# EAGLE design Telit2XBEE (EAGLE 7.5.0)
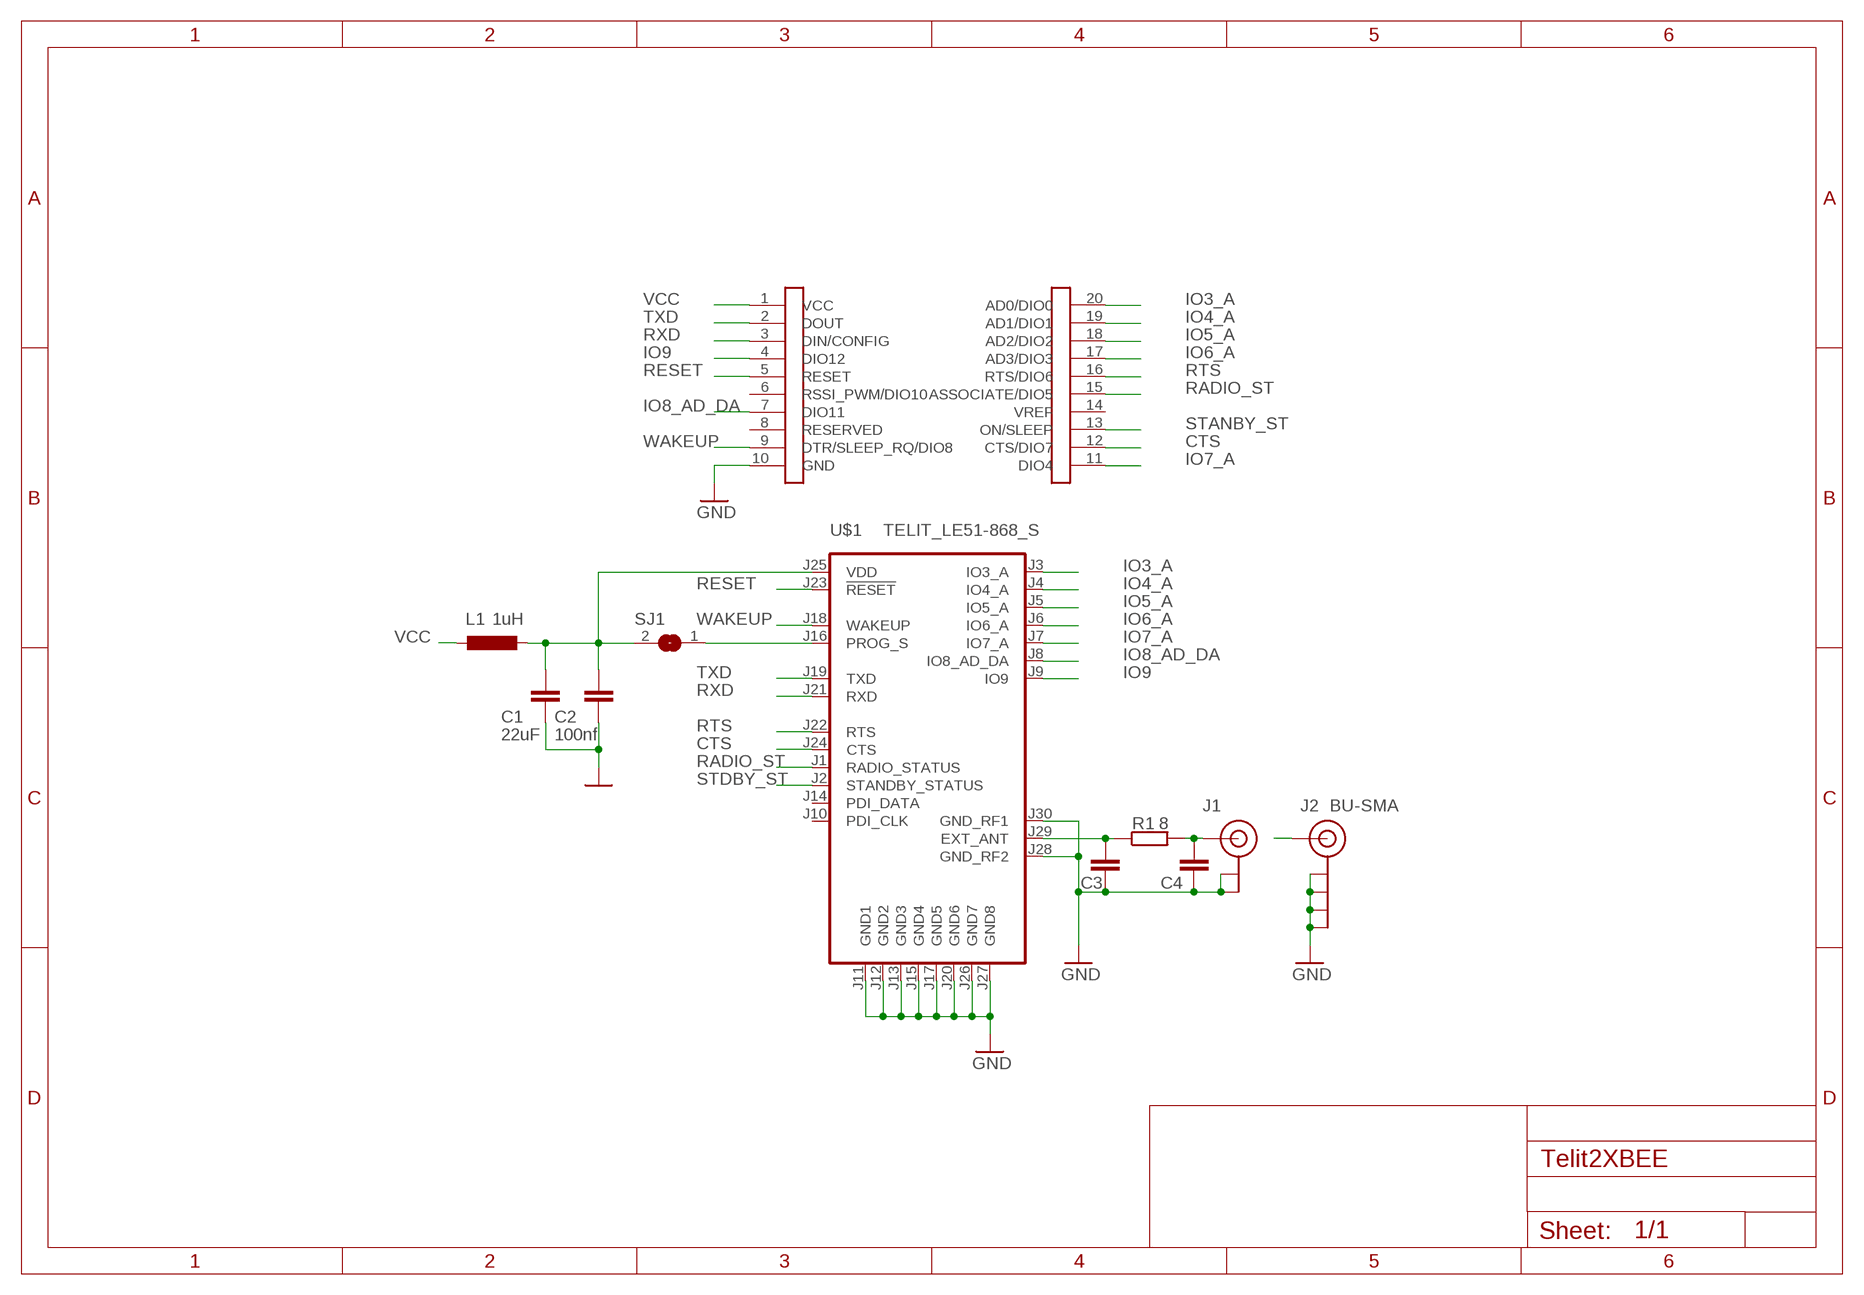
[diagram p0: schematic, sheet 1]

## Parts
C1  22uF  C-EUC1206  [C1206]
C2  100nf  C-EUC0805  [C0805]
C3  C-EUC0201  [C0201]
C4  C-EUC0201  [C0201]
J1  U.FL  U.FL1PAD  [U.FL_1PAD]
J2  BU-SMA  [BU-SMA-G]
L1  1uH  POWER_INDUCTOR3  [COILCRAFT_LPS3015]
R1  8  R-EU_R0201  [R0201]
SJ1  SJ  [SJ]
U$1  TELIT_LE51-868_S  TELIT_LE51  [TELIT_LE51]
U$2  XBEE_PIN_HEADER  [XBEE_PIN_HEADER]

## Nets
CTS: U$1.J24(CTS) U$2.12(CTS/DIO7)
GND: C1.2 C2.2 C3.2 C4.2 J1.P$1(GND) J1.P$2(GND) J2.P$2(GND) J2.P$3(GND) J2.P$5(GND) J2.P$6(GND) U$1.J11(GND1) U$1.J12(GND2) U$1.J13(GND3) U$1.J15(GND4) U$1.J17(GND5) U$1.J20(GND6) U$1.J26(GND7) U$1.J27(GND8) U$1.J28(GND_RF2) U$1.J30(GND_RF1) U$2.10(GND)
IO3_A: U$1.J3(IO3_A) U$2.20(AD0/DIO0)
IO4_A: U$1.J4(IO4_A) U$2.19(AD1/DIO1)
IO5_A: U$1.J5(IO5_A) U$2.18(AD2/DIO2)
IO6_A: U$1.J6(IO6_A) U$2.17(AD3/DIO3)
IO7_A: U$1.J7(IO7_A) U$2.11(DIO4)
IO8_AD_DA: U$1.J8(IO8_AD_DA) U$2.7(DIO11)
IO9: U$1.J9(IO9) U$2.4(DIO12)
N$1: SJ1.1 U$1.J16(PROG_S)
N$2: C4.1 J1.P$3(SIGNAL) J2.P$1(SIGNAL) R1.2
N$3: C3.1 R1.1 U$1.J29(EXT_ANT)
N$18 [VCC1]: C1.1 C2.1 L1.P$2 SJ1.2 U$1.J25(VDD)
RADIO_ST: U$1.J1(RADIO_STATUS) U$2.15(ASSOCIATE/DIO5)
RESET: U$1.J23(!RESET) U$2.5(RESET)
RTS: U$1.J22(RTS) U$2.16(RTS/DIO6)
RXD: U$1.J21(RXD) U$2.3(DIN/CONFIG)
STANBY_ST: U$2.13(ON/SLEEP)
STDBY_ST: U$1.J2(STANDBY_STATUS)
TXD: U$1.J19(TXD) U$2.2(DOUT)
VCC [VCC1]: L1.P$1 U$2.1(VCC)
WAKEUP: U$1.J18(WAKEUP) U$2.9(DTR/SLEEP_RQ/DIO8)
Unconnected: U$1.J10(PDI_CLK) U$1.J14(PDI_DATA) U$2.6(RSSI_PWM/DIO10) U$2.8(RESERVED) U$2.14(VREF)

## Library data of the parts
C1-C4 = resistor:C-EU: CAPACITOR, European symbol
J1 = Multiconnect_base:U.FL: SMD antenna connector- WRL-09144
J2 = Multiconnect_base:BU-SMA
L1 = Multiconnect_base:POWER_INDUCTOR: COILCRAFT
R1 = resistor:R-EU_: RESISTOR, European symbol
SJ1 = jumper:SJ: SMD solder JUMPER
U$1 = Multiconnect_base:TELIT_LE51
U$2 = Multiconnect_base:XBEE_PIN_HEADER

## Net classes
0 default: width 0.152 mm, clearance 0.152 mm
1 VCC1: width 0.254 mm, clearance 0.152 mm

## Board
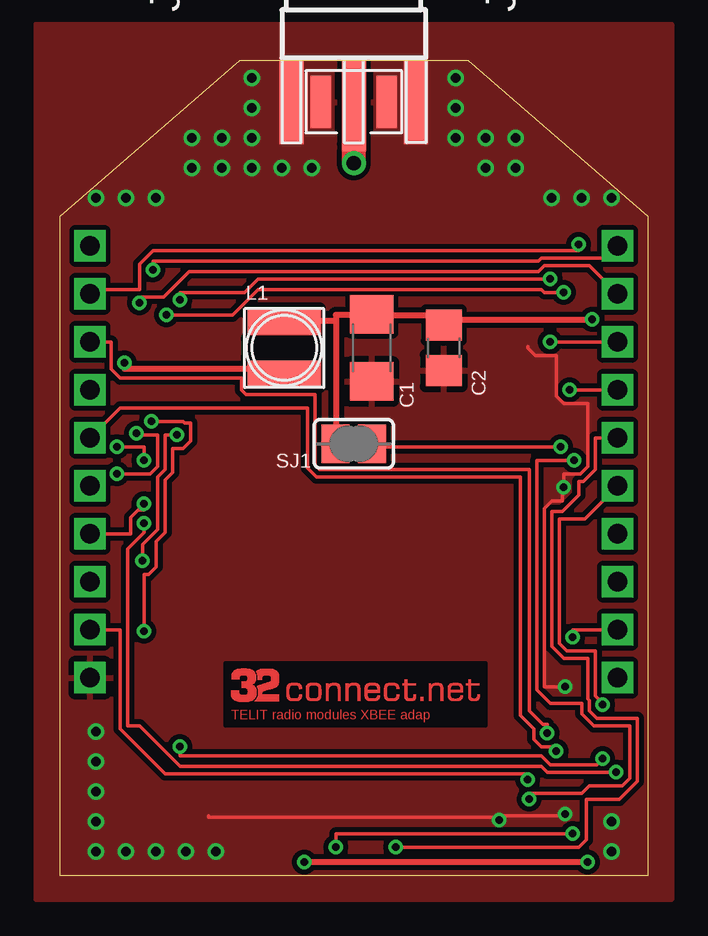
[diagram p1: board, top side]
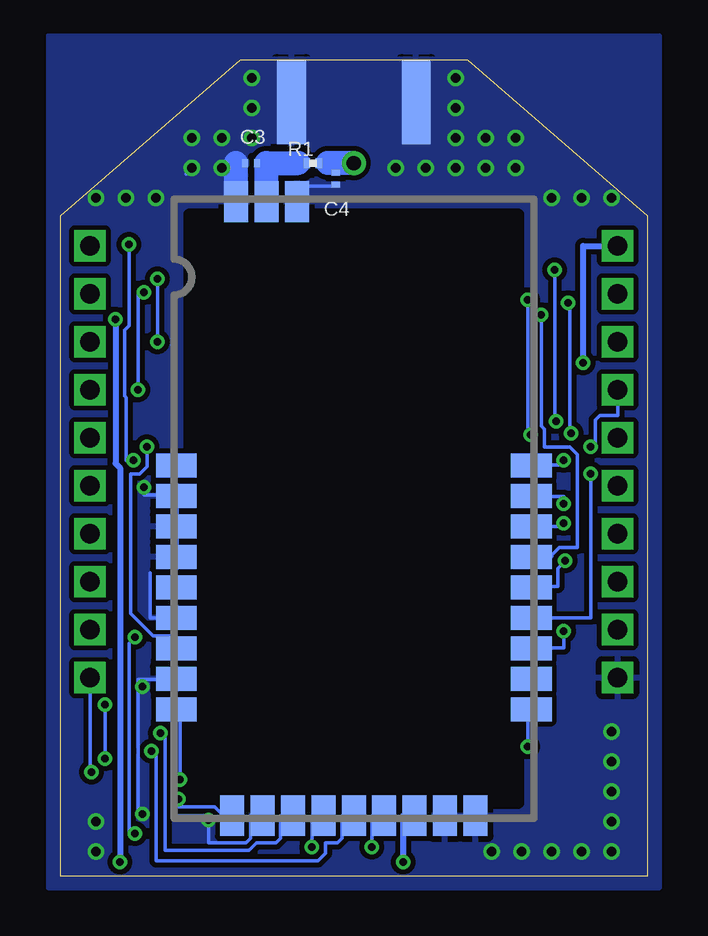
[diagram p2: board, bottom side, seen from below]

Size 24.5 x 34 mm. Coordinates in mm from the lower left corner, seen from the top.
Outline: 0,0 0,27.5 7.5,34 17,34 24.5,27.5 24.5,0 0,0
Copper layers (1*16): Top 0.035mm / dielectric 1.5mm / Bottom 0.035mm
Design rules "default *": minimum track width 6mil, minimum drill 12mil, track to track 6mil, track to pad 6mil, pad to pad 6mil, via to via 6mil, smd to smd 6mil, copper to edge 0mil, drill to drill 8mil, minimum pad ring 10mil, minimum via ring 6mil, stop-mask expansion 4mil, vias tented up to drill 0mil, thermal gap 10mil
tRestrict: area 7.9,21.6 to 10.8,22.4

### Footprints (pad centres in the part's own frame; a part is rotated, then mirrored left to right if it is on the bottom)
C1206 = smd 1.6 x 1.8: 1 -1.4,0; 2 1.4,0
C0805 = smd 1.3 x 1.5: 1 -0.95,0; 2 0.95,0
C0201 = smd 0.25 x 0.35: 1 -0.25,0; 2 0.25,0
U.FL_1PAD = smd 2.2 x 0.85: P$1 0,1.375; P$2 0,-1.375 | smd 1.05 x 1: P$3 -1.525,0
BU-SMA-G = smd 3.5 x 1: P$1 -5.26,0; P$2 -5.26,2.6; P$3 -5.26,-2.6 | smd 3.5 x 1.2 bottom: P$5 -5.26,2.6; P$6 -5.26,-2.6
COILCRAFT_LPS3015 = smd 3.05 x 1.14: P$1 -0.1,1.1; P$2 -0.1,-1.1
R0201 = smd 0.28 x 0.43: 1 -0.255,0; 2 0.255,0
SJ = smd 1.168 x 1.6: 1 -0.762,0; 2 0.762,0
TELIT_LE51 = smd 1 x 1.7: J1 4.43,0; J2 5.7,0; J3 6.97,0; J4 8.24,0; J5 9.51,0; J6 10.78,0; J7 12.05,0; J8 13.32,0; J9 14.59,0; J10 14.59,14.8; J11 13.32,14.8; J12 12.05,14.8; J13 10.78,14.8; J14 9.51,14.8; J15 8.24,14.8; J16 6.97,14.8; J17 5.7,14.8; J18 4.43,14.8 | smd 1.7 x 1: J19 0,12.48; J20 0,11.21; J21 0,9.94; J22 0,8.67; J23 0,7.4; J24 0,6.13; J25 0,4.86; J26 0,3.59; J27 0,2.32; J28 25.59,9.77; J29 25.59,11.04; J30 25.59,12.31
XBEE_PIN_HEADER = drill 0.8 square: 1 0,18; 2 0,16; 3 0,14; 4 0,12; 5 0,10; 6 0,8; 7 0,6; 8 0,4; 9 0,2; 10 0,0; 11 22,0; 12 22,2; 13 22,4; 14 22,6; 15 22,8; 16 22,10; 17 22,12; 18 22,14; 19 22,16; 20 22,18

### Placement (x,y rotation side)
C1  13,22 270 top
C2  16,22 270 top
C3  16.52,29.7 180 bottom
C4  13,29.05 270 bottom
J1  12.25,32.25 90 top
J2  12.25,37.5 90 top
L1  9.25,22 180 top
R1  13.95,29.7 0 bottom
SJ1  12.25,18 180 top
U$1  4.85,2.5 90 bottom
U$2  1.25,8.25 0 top

### Tracks (layer width: path | path; a pad name or v marks a point on that pad's centre or on a via)
CTS  (via drill 0.3)
  Top 0.152: v11.5,1.19 11.5,1.75 v21.38,1.75 | v21.38,9.94 21.38,10.25 U$2.12
  Bottom 0.152: U$1.J24 11.5,2.5 v11.5,1.19 | v21.38,1.75 21.62,1.75 21.62,9.69 v21.38,9.94
GND  (via drill 0.3, 0.4)
  Top 0.152: 16,20.62 C2.2 16.06,21.06 | 13,20.62 C1.2 | 19.5,22.06 19.5,22 19.81,21.69 20.69,21.69 20.69,20 21,19.69 22,19.69 22,17.06 21.69,16.75 21,16.75 v21,16.19 20.94,16.19 20.94,15.62 20.5,15.62 20.19,15.31 20.19,7.88 v21.06,7.88 | v21.06,2.56 21.06,2.5 18.31,2.5 v18.31,2.31 18.31,2.44 6.19,2.44 6.19,2.5
  Bottom 0.152: 20.75,12.62 20.75,10.75 19.69,10.75 U$1.J15 | 19.69,13.25 U$1.J13 19.62,13.31 19.62,14.5 U$1.J12 19.62,14.56 19.62,15.81 U$1.J11 19.69,15.88 21,15.88 v21,16.19 | v19,29.5 19.25,29.25 | C4.2 13,28.75 14.56,28.75 14.56,28.12 U$1.J28 | U$1.J26 U$1.J27 7.12,2.44 6.19,2.44 | U$1.J20 16.56,2.5 16.56,1.56 16.75,1.38 18.31,1.38 v18.31,2.31 | 21.25,7.88 21.25,2.75 v21.06,2.56 | 21.25,7.88 21.25,8.19 19.69,8.19 U$1.J17 | 21.25,7.88 v21.06,7.88
  Bottom 1: 17.16,28.6 17.16,29.7
  other vias: 8,33.25 8,32 5.5,30.75 6.75,30.75 8,30.75 5.5,29.5 6.75,29.5 8,29.5 9.25,29.5 10.5,29.5 16.5,33.25 16.5,32 16.5,30.75 17.75,30.75 19,30.75 17.75,29.5 4,28.25 2.75,28.25 1.5,28.25 23,28.25 21.75,28.25 20.5,28.25 1.5,1 2.75,1 4,1 5.25,1 6.5,1 23,1 23,2.25 1.5,2.25 1.5,3.5 1.5,4.75 1.5,6
  pour Bottom (isolate 0.305, no thermals): 24.5,28.25 24.5,34 0,34 0,28.25
  pour Top (isolate 0.305, no thermals): 0,28.25 0,34.5 24.5,34.5 24.5,28.25
  cutout Top: 6.88,6.25 6.88,8.88 17.75,8.88 17.75,6.25
  pour Bottom (isolate 0.203, rank 2): -0.5,-0.5 -0.5,35 25,35 25,-0.5
  pour Top (isolate 0.203, rank 2): -1,-1 -1,35.5 25.5,35.5 25.5,-1
IO3_A  (via drill 0.3)
  Top 0.152: v3.5,10.19 3.5,12.56 3.69,12.56 4,12.88 4,13.94 4.38,14.31 4.38,16.5 4.69,16.81 4.69,17.81 5.12,17.81 5.44,18.12 5.44,18.88 5.19,18.88 5.12,18.94 v3.81,18.94 | v3.88,25.25 3.88,25.62 19.94,25.62 20.06,25.75 22.75,25.75 U$2.20
  Bottom 0.152: v3.5,10.19 3.5,9.5 4.81,9.5 U$1.J3 | v3.81,18.94 3.88,18.94 v3.88,25.25
IO4_A  (via drill 0.3)
  Top 0.152: v2.38,16.75 3.75,16.75 4.06,17.06 4.06,18.38 3.25,18.38 v3.19,18.44 | v3.31,23.88 3.31,24.12 4.31,24.12 5.38,25.19 19.94,25.19 20.19,25.44 22.06,25.44 U$2.19
  Bottom 0.152: v2.38,16.75 2.38,10.75 4.81,10.75 U$1.J4 | v3.19,18.44 3.25,18.44 3.25,23.81 v3.31,23.88
IO5_A  (via drill 0.3)
  Top 0.152: v3.44,13.12 3.44,13.81 4.06,14.44 4.06,16.62 4.38,16.94 4.38,18.38 v4.88,18.38 | v5,24 5,24.31 7.69,24.31 8.25,24.88 v20.44,24.88 | U$2.18 v20.44,22.25
  Bottom 0.152: v3.44,13.12 3.75,12.81 3.75,12.06 4.81,12.06 U$1.J5 | v4.88,18.38 5,18.38 v5,24 | v20.44,22.25 v20.44,24.88
IO6_A  (via drill 0.3)
  Top 0.152: v4.44,23.38 7.19,23.38 8.25,24.44 20.06,24.44 20.19,24.31 v21,24.31 | U$2.17 v21.25,20.25
  Bottom 0.152: v4.44,23.38 4.44,18.75 4.31,18.62 4.31,17.88 3.25,17.88 2.94,17.56 2.94,13.69 3.69,13.69 4,13.38 4,13.31 4.81,13.31 U$1.J6 | v21,24.31 21.25,24.31 v21.25,20.25
IO7_A  (via drill 0.3)
  Top 0.152: v3.5,14.69 3.5,14.31 2.81,13.62 2.81,6.25 3.31,6.25 5,4.56 20.06,4.56 20.31,4.31 v23.19,4.31
  Bottom 0.152: v3.5,14.69 3.5,14.56 4.81,14.56 U$1.J7 | v23.19,4.31 23.25,4.31 U$2.11
IO8_AD_DA  (via drill 0.3)
  Top 0.152: v3.5,15.5 3.5,15.25 3.25,15.25 2.94,14.94 2.94,14.25 U$2.7
  Bottom 0.152: v3.5,15.5 3.5,15.81 4.81,15.81 U$1.J8
IO9  (via drill 0.3)
  Top 0.152: v3.5,17.31 3.5,17.88 v2.38,17.88
  Bottom 0.152: v3.5,17.31 3.5,17.12 4.81,17.12 U$1.J9 | v2.38,17.88 2.19,17.88 2.19,19 2,19.19 1.25,19.19 U$2.4
N$1  (via drill 0.3)
  Top 0.152: v20.88,17.88 13.06,17.88 13.06,18 SJ1.1
  Bottom 0.152: v20.88,17.88 20.88,17.06 21.19,16.75 21.56,16.75 21.56,10.94 20.62,10 19.69,10 19.69,9.5 U$1.J16
N$2  (via drill 0.6 pad 1)
  Top 0.152: 12.25,30.15 J1.P$3 J2.P$1
  Top 1: v12.25,29.7 12.25,30.15
  Bottom 0.152: C4.1 13,29.31 13,29.7 | 13.34,29.7 13.69,29.69 R1.2
  Bottom 1: v12.25,29.7 13,29.7 13.34,29.7
N$3
  Bottom 0.152: C3.1 16.31,29.75 15.89,29.7 | 14.56,29.7 14.25,29.69 R1.1 | 15.89,28.6 15.88,28.12 U$1.J29
  Bottom 1: 15.89,28.6 15.89,29.7 14.56,29.7
N$18  (via drill 0.3)
  Top 0.254: 11.5,23.12 11.5,23.38 12.88,23.38 C1.1 13,23.38 16,23.38 C2.1 16.12,23.19 v22.19,23.19 | 11.5,23.12 SJ1.2 | v22,0.56 v10.19,0.56 | 11.5,23.12 9.38,23.12 L1.P$2
  Bottom 0.254: U$1.J25 10.19,2.5 v10.19,0.56 | v22,0.56 22,17 22.19,17.19 v22.19,23.19
RADIO_ST  (via drill 0.3)
  Top 0.152: v5,5.38 5,5 20.06,5 20.44,4.62 22.38,4.62 v22.62,4.88 | v22.62,7.12 22.62,7.31 22.5,7.31 22.31,7.5 22.31,9.38 21.12,9.38 20.81,9.69 20.81,14.88 21.88,14.88 U$2.15
  Bottom 0.152: v5,5.38 5,6.88 4.88,6.88 U$1.J1 | v22.62,7.12 v22.62,4.88
RESET  (via drill 0.3)
  Top 0.152: v20.69,5.19 20.69,5.38 20.06,5.38 19.75,5.69 19.75,6.12 19.19,6.69 19.19,16.62 10.69,16.62 10.31,17 10.31,19.5 2.5,19.5 U$2.5
  Bottom 0.152: U$1.J23 12.75,2.5 12.75,1.56 12.94,1.38 13.44,1.38 13.44,0.94 13.75,0.62 20.5,0.62 20.5,5 v20.69,5.19
RTS  (via drill 0.3)
  Top 0.152: v14,1.19 21.62,1.19 21.94,1.5 21.94,3.19 23.31,3.19 24.06,3.94 24.06,6.56 22.38,6.56 22.06,6.88 22.06,7.31 22,7.38 22,9.06 21,9.06 20.5,9.56 20.5,15.19 20.94,15.19 21.62,15.88 21.62,16.44 21.81,16.44 22.31,16.94 22.31,18.25 U$2.16
  Bottom 0.152: U$1.J22 14,2.5 v14,1.19
RXD  (via drill 0.3)
  Top 0.152: v20.31,5.94 20.31,6.31 20.12,6.31 19.56,6.88 19.56,16.94 10.81,16.94 10.62,17.12 10.62,20.06 7.75,20.06 7.56,20.25 7.56,20.75 2.5,20.75 2.12,21.12 2.12,22.25 U$2.3
  Bottom 0.152: U$1.J21 15.31,2.5 15.31,1.56 15.5,1.38 16.31,1.38 16.62,1.06 20.12,1.06 20.12,5.75 v20.31,5.94
TXD  (via drill 0.3)
  Top 0.152: v19.56,3.19 19.56,3.44 21.75,3.44 22.06,3.75 23.44,3.75 23.75,4.06 23.75,6.25 22.25,6.25 21.75,6.75 21.75,7.19 20.44,7.19 19.88,7.75 19.88,17.31 v21.44,17.31 | v21.62,26.31 21.62,26.06 3.88,26.06 3.31,25.5 3.31,24.44 1.44,24.44 U$2.2
  Bottom 0.152: U$1.J19 17.75,2.5 17.75,2.56 18.06,2.88 19.56,2.88 v19.56,3.19 | v21.44,17.31 21.75,17.31 21.75,19.94 21.81,20 21.81,22.75 21.62,22.94 v21.62,26.31
VCC  (via drill 0.3)
  Top 0.254: v2.69,21.38 2.69,21.12 9.12,21.12 L1.P$1
  Bottom 0.254: U$2.1 2.69,26.25 v2.69,21.38
WAKEUP  (via drill 0.3)
  Top 0.152: v19.5,4 19.5,4.25 4.38,4.25 2.5,6.12 2.5,10.25 U$2.9
  Bottom 0.152: v19.5,4 19.5,6.88 19.62,6.88 U$1.J18
(copper drawn outside any net)
  shapes: Bottom area x1, Top area x27615

### Text on the board
Top: TELIT radio modules XBEE adap